# EAGLE schematic stm32-d40-platform (EAGLE 6.4)

## Sheet 1 of 3
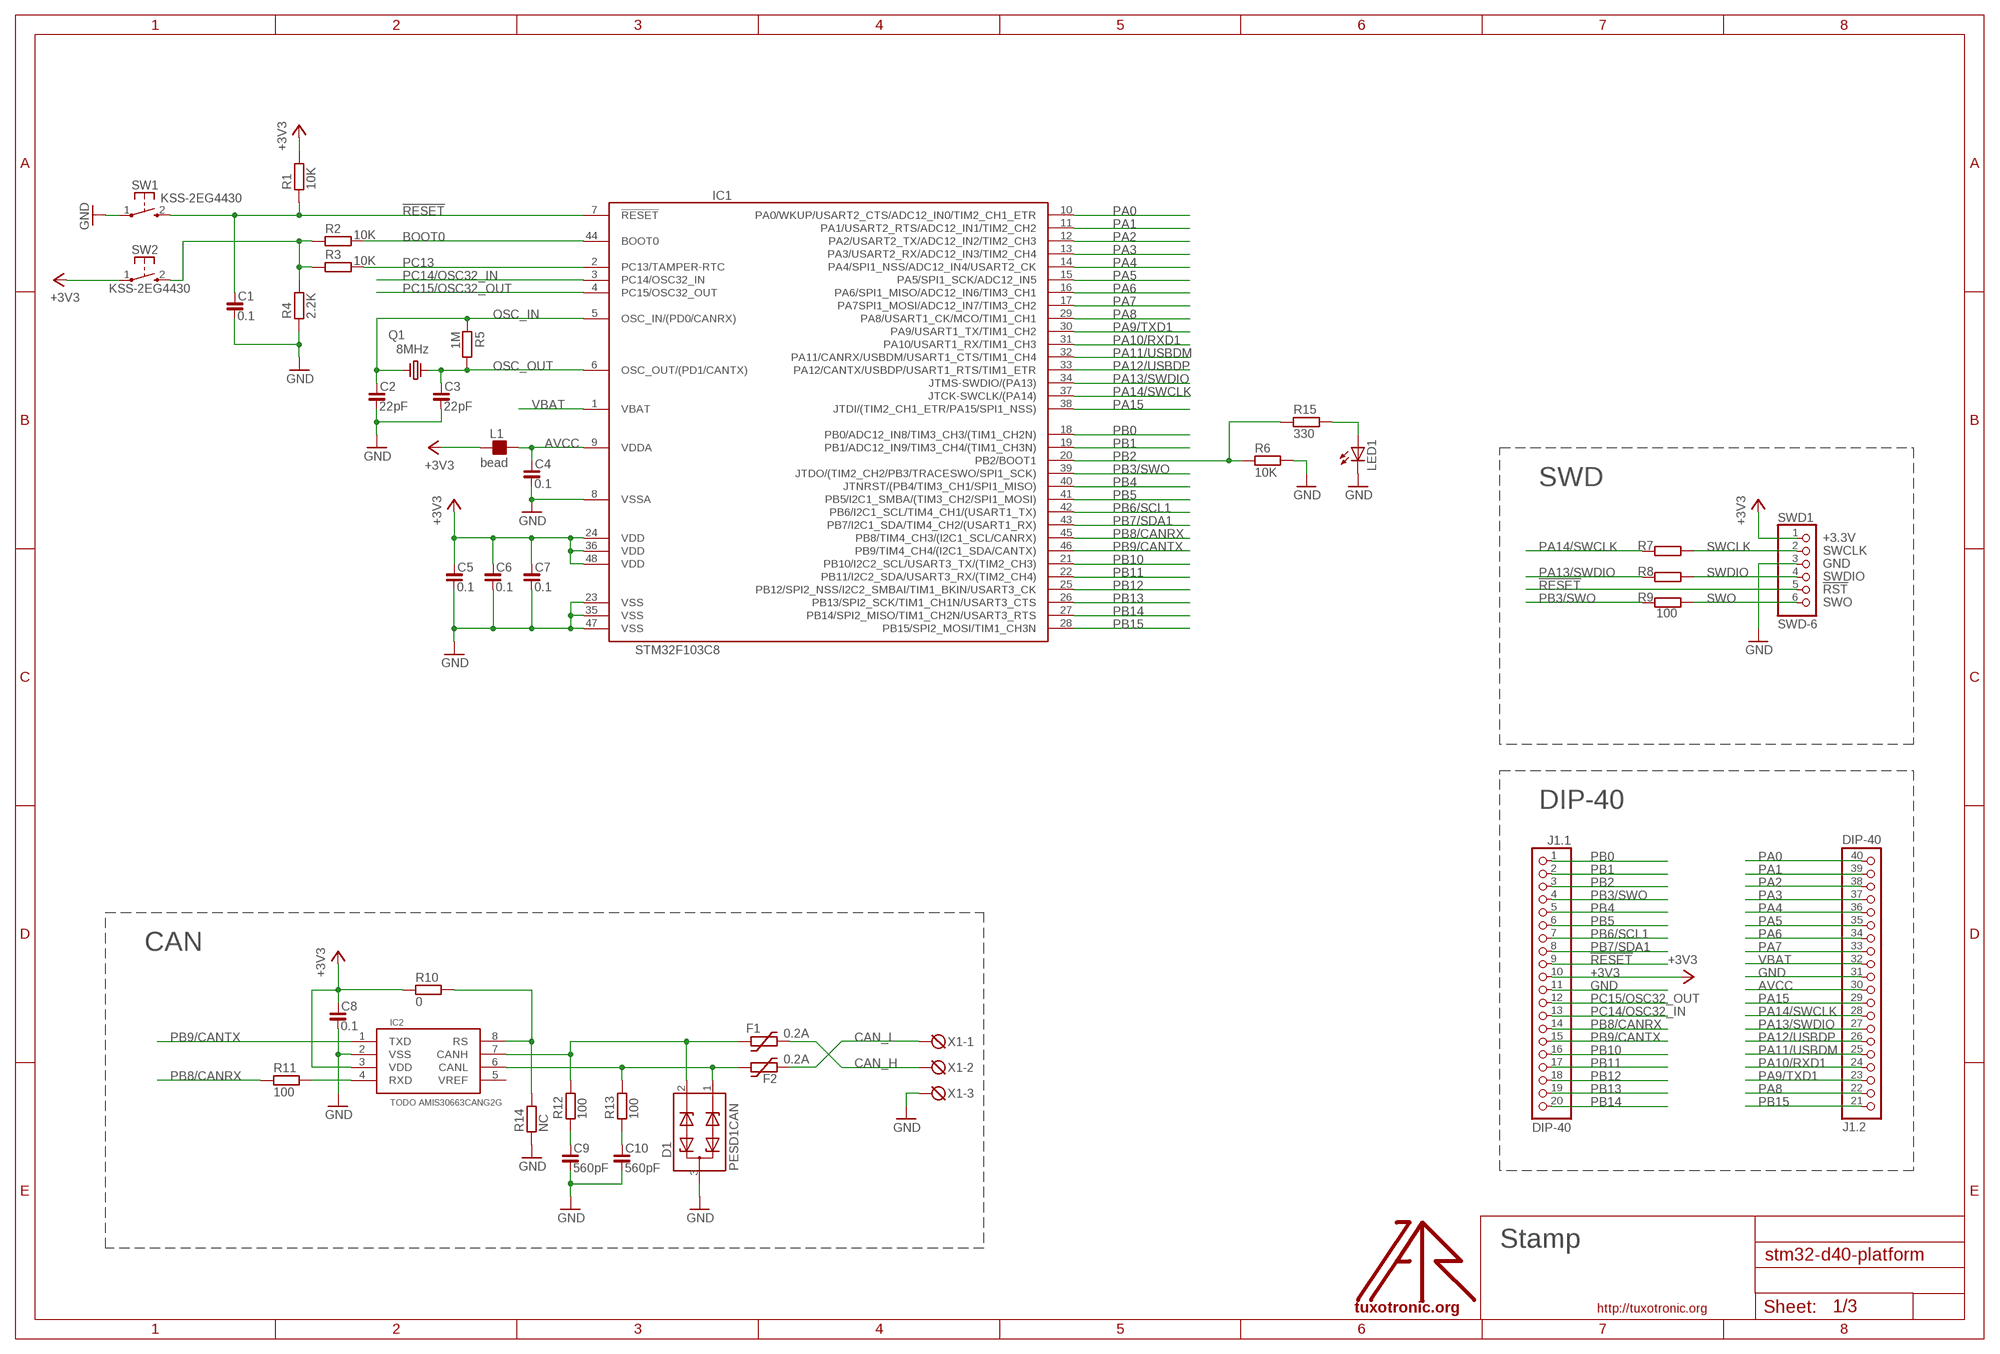
[diagram p0: schematic, sheet 1]

### Parts
C1  0.1  C_0603  [C0603]
C2  22pF  C_0603  [C0603]
C3  22pF  C_0603  [C0603]
C4  0.1  C_0603  [C0603]
C5  0.1  C_0603  [C0603]
C6  0.1  C_0603  [C0603]
C7  0.1  C_0603  [C0603]
C8  0.1  C_0603  [C0603]
C9  560pF  C_0603  [C0603]
C10  560pF  C_0603  [C0603]
D1  PESD1CAN  [SOT23]
F1  0.2A  1206L  [1206L]
F2  0.2A  1206L  [1206L]
IC1  STM32F103C8  [LQFP48]
IC2  TODO AMIS30663CANG2G  SN65HVD230  [SO08]
J1  DIP-40  [DIP-40]
L1  bead  FB_0603  [L0603]
LED1  LEDCHIPLED_0603  [CHIPLED_0603]
Q1  8MHz  CRYSTAL-HC49S  [HC49/S]
R1  10K  R_0603  [R0603]
R2  10K  R_0603  [R0603]
R3  10K  R_0603  [R0603]
R4  2.2K  R_0603  [R0603]
R5  1M  R_0603  [R0603]
R6  10K  R_0603  [R0603]
R7  100  R_0603  [R0603]
R8  100  R_0603  [R0603]
R9  100  R_0603  [R0603]
R10  0  R_0603  [R0603]
R11  100  R_0603  [R0603]
R12  100  R_0603  [R0603]
R13  100  R_0603  [R0603]
R14  NC  R_0603  [R0603]
R15  330  R_0603  [R0603]
SW1  KSS-2EG4430  [KSS-2EG4430]
SW2  KSS-2EG4430  [KSS-2EG4430]
SWD1  SWD-6  [JTAG6PIN]
U$  LOGO  [TT_LOGO]
X1  DG3XX-03-3.5  [DG350-3.5-03P]

### Nets
!RESET: C1.1 IC1.7(!RESET) J1.9 R1.1 SW1.2(S) SWD1.5 ; also sheet 3
+3V3: C5.1 C6.1 C7.1 C8.1 IC1.24(VDD) IC1.36(VDD) IC1.48(VDD) IC2.3(VDD) J1.10 L1.1 R1.2 R10.1 SW2.1(P) SWD1.1 ; also sheet 3
AVCC: C4.1 IC1.9(VDDA) J1.30 L1.2
BOOT0: IC1.44(BOOT0) R2.2
CAN_CTRL: IC2.8(RS) R10.2 R14.2
CAN_H: F1.P$2 X1.2
CAN_L: F2.P$2 X1.1
GND: C1.2 C2.2 C3.2 C4.2 C5.2 C6.2 C7.2 C8.2 C9.2 C10.2 D1.3 IC1.8(VSSA) IC1.23(VSS) IC1.35(VSS) IC1.47(VSS) IC2.2(VSS) J1.11 J1.31 LED1.C R4.1 R6.2 R14.1 SW1.1(P) SWD1.3 X1.3 ; also sheet 2,3
N$1: R2.1 R3.1 R4.2 SW2.2(S)
N$5: LED1.A R15.2
N$7: IC2.4(RXD) R11.2
N$51: D1.2 F1.P$1 IC2.7(CANH) R12.2
N$52: D1.1 F2.P$1 IC2.6(CANL) R13.2
N$54: C10.1 R13.1
N$55: C9.1 R12.1
OSC_IN: C2.1 IC1.5(OSC_IN/(PD0/CANRX)) Q1.1 R5.1
OSC_OUT: C3.1 IC1.6(OSC_OUT/(PD1/CANTX)) Q1.2 R5.2
PA0: IC1.10(PA0/WKUP/USART2_CTS/ADC12_IN0/TIM2_CH1_ETR) J1.40
PA1: IC1.11(PA1/USART2_RTS/ADC12_IN1/TIM2_CH2) J1.39
PA2: IC1.12(PA2/USART2_TX/ADC12_IN2/TIM2_CH3) J1.38
PA3: IC1.13(PA3/USART2_RX/ADC12_IN3/TIM2_CH4) J1.37
PA4: IC1.14(PA4/SPI1_NSS/ADC12_IN4/USART2_CK) J1.36
PA5: IC1.15(PA5/SPI1_SCK/ADC12_IN5) J1.35
PA6: IC1.16(PA6/SPI1_MISO/ADC12_IN6/TIM3_CH1) J1.34
PA7: IC1.17(PA7SPI1_MOSI/ADC12_IN7/TIM3_CH2) J1.33
PA8: IC1.29(PA8/USART1_CK/MCO/TIM1_CH1) J1.22
PA9/TXD1: IC1.30(PA9/USART1_TX/TIM1_CH2) J1.23
PA10/RXD1: IC1.31(PA10/USART1_RX/TIM1_CH3) J1.24
PA11/USBDM: IC1.32(PA11/CANRX/USBDM/USART1_CTS/TIM1_CH4) J1.25
PA12/USBDP: IC1.33(PA12/CANTX/USBDP/USART1_RTS/TIM1_ETR) J1.26
PA13/SWDIO: IC1.34(JTMS-SWDIO/(PA13)) J1.27 R8.1
PA14/SWCLK: IC1.37(JTCK-SWCLK/(PA14)) J1.28 R7.1
PA15: IC1.38(JTDI/(TIM2_CH1_ETR/PA15/SPI1_NSS)) J1.29
PB0: IC1.18(PB0/ADC12_IN8/TIM3_CH3/(TIM1_CH2N)) J1.1
PB1: IC1.19(PB1/ADC12_IN9/TIM3_CH4/(TIM1_CH3N)) J1.2
PB2: IC1.20(PB2/BOOT1) J1.3 R6.1 R15.1
PB3/SWO: IC1.39(JTDO/(TIM2_CH2/PB3/TRACESWO/SPI1_SCK)) J1.4 R9.1
PB4: IC1.40(JTNRST/(PB4/TIM3_CH1/SPI1_MISO)) J1.5
PB5: IC1.41(PB5/I2C1_SMBA/(TIM3_CH2/SPI1_MOSI)) J1.6
PB6/SCL1: IC1.42(PB6/I2C1_SCL/TIM4_CH1/(USART1_TX)) J1.7
PB7/SDA1: IC1.43(PB7/I2C1_SDA/TIM4_CH2/(USART1_RX)) J1.8
PB8/CANRX: IC1.45(PB8/TIM4_CH3/(I2C1_SCL/CANRX)) J1.14 R11.1
PB9/CANTX: IC1.46(PB9/TIM4_CH4/(I2C1_SDA/CANTX)) IC2.1(TXD) J1.15
PB10: IC1.21(PB10/I2C2_SCL/USART3_TX/(TIM2_CH3)) J1.16
PB11: IC1.22(PB11/I2C2_SDA/USART3_RX/(TIM2_CH4)) J1.17
PB12: IC1.25(PB12/SPI2_NSS/I2C2_SMBAI/TIM1_BKIN/USART3_CK) J1.18
PB13: IC1.26(PB13/SPI2_SCK/TIM1_CH1N/USART3_CTS) J1.19
PB14: IC1.27(PB14/SPI2_MISO/TIM1_CH2N/USART3_RTS) J1.20
PB15: IC1.28(PB15/SPI2_MOSI/TIM1_CH3N) J1.21
PC13: IC1.2(PC13/TAMPER-RTC) R3.2
PC14/OSC32_IN: IC1.3(PC14/OSC32_IN) J1.13
PC15/OSC32_OUT: IC1.4(PC15/OSC32_OUT) J1.12
SWCLK: R7.2 SWD1.2 ; also sheet 3
SWDIO: R8.2 SWD1.4 ; also sheet 3
SWO: R9.2 SWD1.6 ; also sheet 3
VBAT: IC1.1(VBAT) J1.32
Unconnected: IC2.5(VREF)

### Notes on the sheet
- SWD
- DIP-40
- CAN
- Stamp

## Sheet 2 of 3
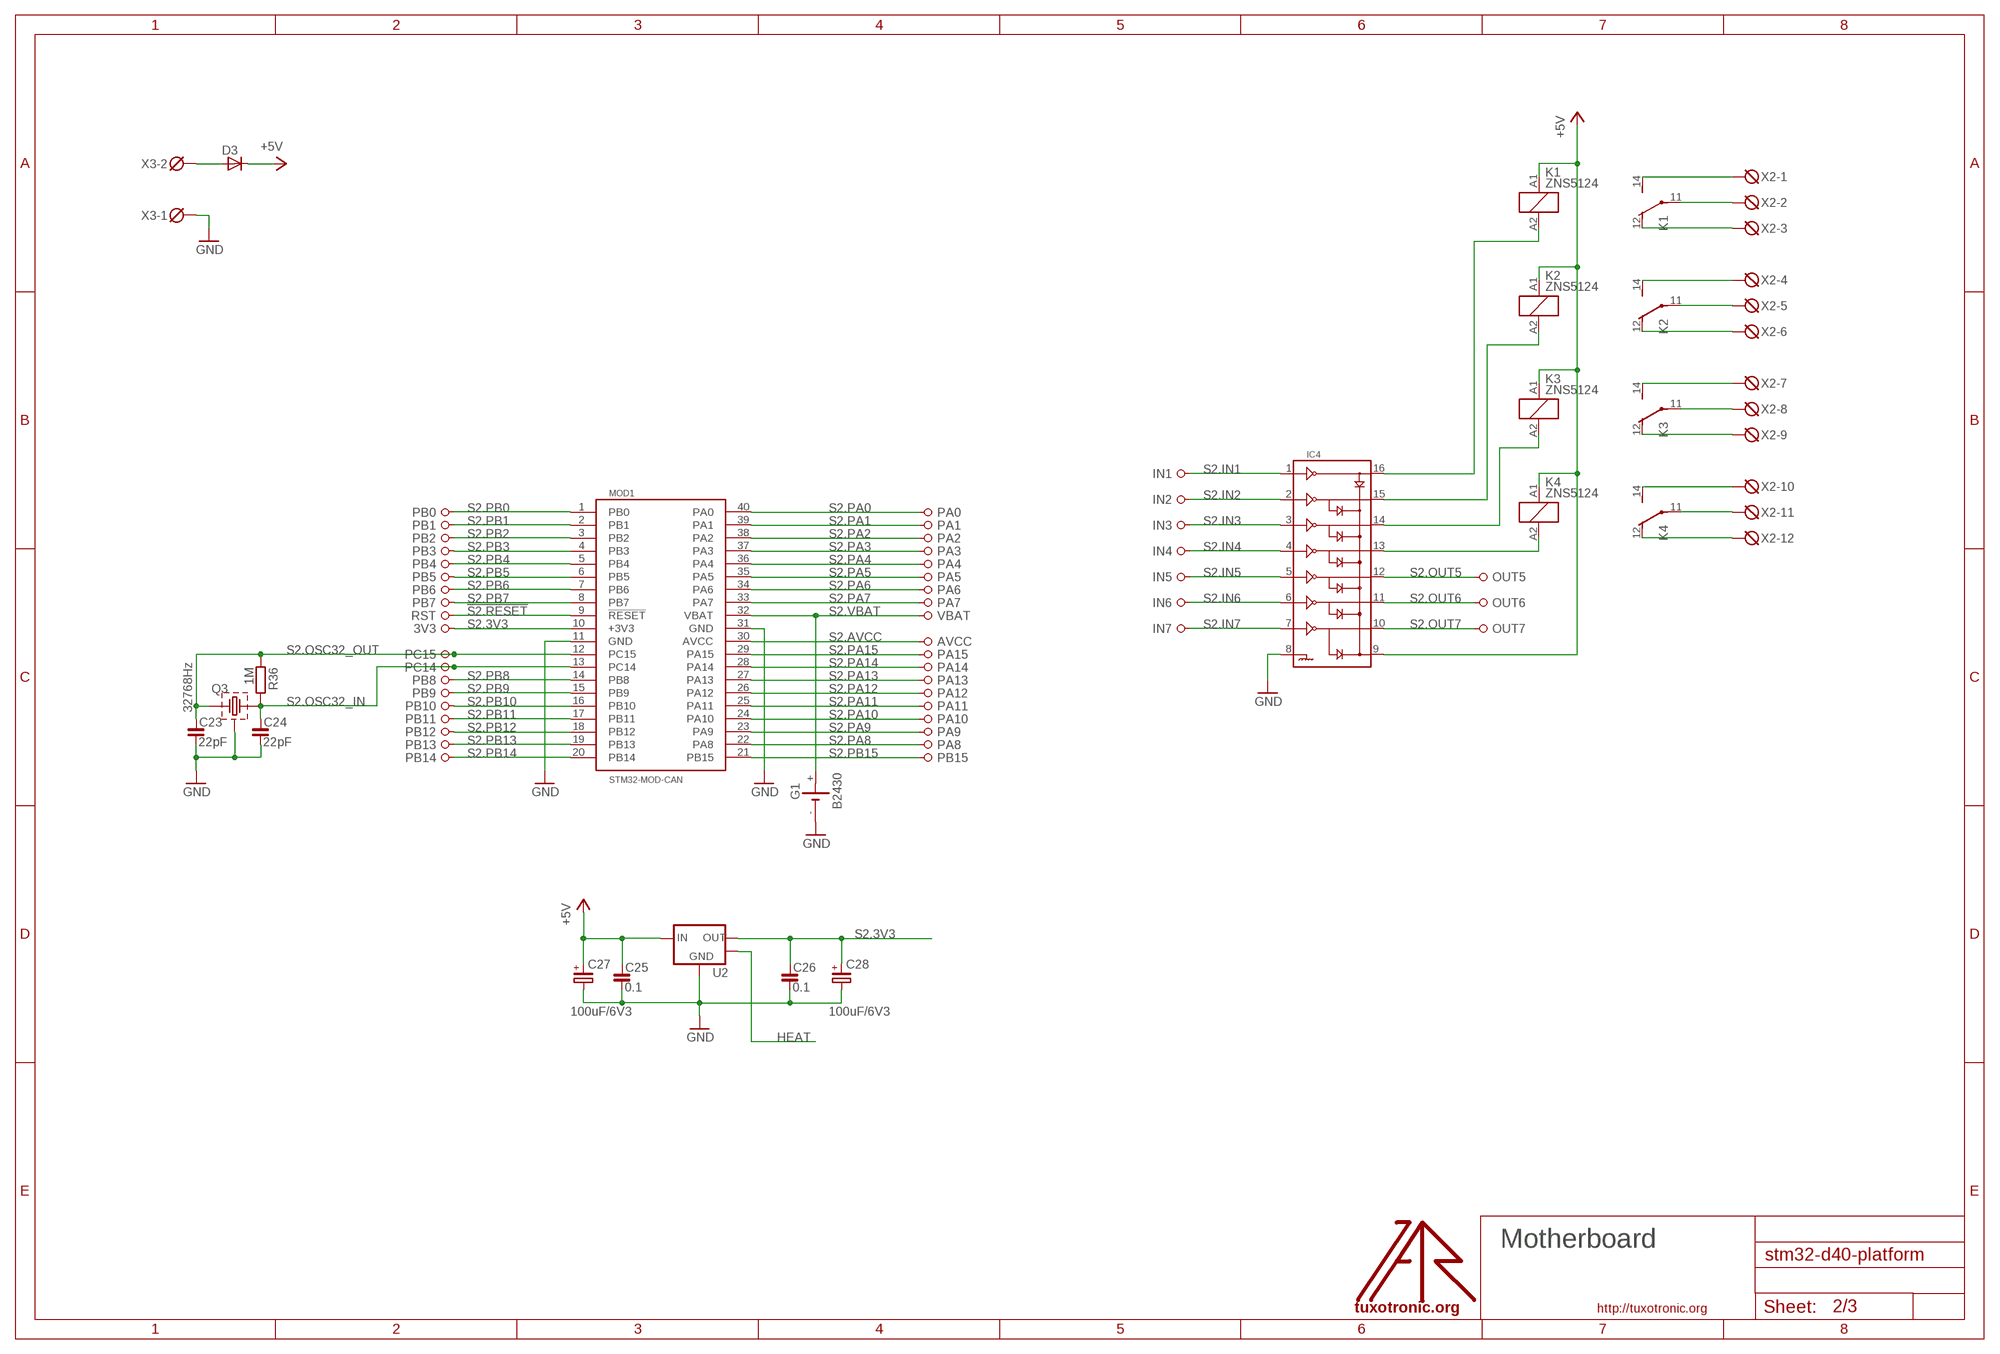
[diagram p1: schematic, sheet 2]

### Parts
3V3  PIN-1X1_2.54  [1X01]
AVCC  PIN-1X1_2.54  [1X01]
C23  22pF  C_0805  [C0805]
C24  22pF  C_0805  [C0805]
C25  0.1  C_0805  [C0805]
C26  0.1  C_0805  [C0805]
C27  100uF/6V3  CP_E-035X080  [CE-035X080]
C28  100uF/6V3  CP_E-035X080  [CE-035X080]
D3  D-SMB  [SMB]
G1  B2430  [B2430]
IC4  ULN2003D  [SO16]
IN1  PIN-1X1_2.54  [1X01]
IN2  PIN-1X1_2.54  [1X01]
IN3  PIN-1X1_2.54  [1X01]
IN4  PIN-1X1_2.54  [1X01]
IN5  PIN-1X1_2.54  [1X01]
IN6  PIN-1X1_2.54  [1X01]
IN7  PIN-1X1_2.54  [1X01]
K1  ZNS5124  [ZN5]
K2  ZNS5124  [ZN5]
K3  ZNS5124  [ZN5]
K4  ZNS5124  [ZN5]
MOD1  STM32-MOD-CAN  [DIL40]
OUT5  PIN-1X1_2.54  [1X01]
OUT6  PIN-1X1_2.54  [1X01]
OUT7  PIN-1X1_2.54  [1X01]
PA0  PIN-1X1_2.54  [1X01]
PA1  PIN-1X1_2.54  [1X01]
PA2  PIN-1X1_2.54  [1X01]
PA3  PIN-1X1_2.54  [1X01]
PA4  PIN-1X1_2.54  [1X01]
PA5  PIN-1X1_2.54  [1X01]
PA6  PIN-1X1_2.54  [1X01]
PA7  PIN-1X1_2.54  [1X01]
PA8  PIN-1X1_2.54  [1X01]
PA9  PIN-1X1_2.54  [1X01]
PA10  PIN-1X1_2.54  [1X01]
PA11  PIN-1X1_2.54  [1X01]
PA12  PIN-1X1_2.54  [1X01]
PA13  PIN-1X1_2.54  [1X01]
PA14  PIN-1X1_2.54  [1X01]
PA15  PIN-1X1_2.54  [1X01]
PB0  PIN-1X1_2.54  [1X01]
PB1  PIN-1X1_2.54  [1X01]
PB2  PIN-1X1_2.54  [1X01]
PB3  PIN-1X1_2.54  [1X01]
PB4  PIN-1X1_2.54  [1X01]
PB5  PIN-1X1_2.54  [1X01]
PB6  PIN-1X1_2.54  [1X01]
PB7  PIN-1X1_2.54  [1X01]
PB8  PIN-1X1_2.54  [1X01]
PB9  PIN-1X1_2.54  [1X01]
PB10  PIN-1X1_2.54  [1X01]
PB11  PIN-1X1_2.54  [1X01]
PB12  PIN-1X1_2.54  [1X01]
PB13  PIN-1X1_2.54  [1X01]
PB14  PIN-1X1_2.54  [1X01]
PB15  PIN-1X1_2.54  [1X01]
PC14  PIN-1X1_2.54  [1X01]
PC15  PIN-1X1_2.54  [1X01]
Q3  32768Hz  CRSTL3-  [TC38H-G]
R36  1M  R_0805  [R0805]
RST  PIN-1X1_2.54  [1X01]
U2  LM1117-3.3  [SOT223]
U$1  LOGO  [TT_LOGO]
VBAT  PIN-1X1_2.54  [1X01]
X2  DG3XX-12-5.0  [DG306-5.0-12P]
X3  DG3XX-02-5.0  [DG306-5.0-02P]

### Nets
!S2.RESET: MOD1.9(!RESET) RST.1
+5V: C25.1 C27.+ D3.C IC4.9 K1.A1 K2.A1 K3.A1 K4.A1 U2.3(IN) ; also sheet 3
GND: C23.2 C24.2 C25.2 C26.2 C27.- C28.- G1.- IC4.8 MOD1.11(GND) MOD1.31(GND) Q3.GND U2.1(GND) X3.1 ; also sheet 1,3
HEAT: U2.4(MASS)
N$11: D3.A X3.2
N$64: K1.14(2:S) X2.1
N$65: K1.11(2:P) X2.2
N$66: K1.12(2:O) X2.3
N$67: K2.14(2:S) X2.4
N$68: K2.11(2:P) X2.5
N$69: K2.12(2:O) X2.6
N$70: K3.14(2:S) X2.7
N$71: K3.11(2:P) X2.8
N$72: K3.12(2:O) X2.9
N$73: K4.14(2:S) X2.10
N$74: K4.11(2:P) X2.11
N$75: K4.12(2:O) X2.12
N$366: IC4.13 K4.A2
N$367: IC4.14 K3.A2
N$368: IC4.15 K2.A2
N$369: IC4.16 K1.A2
S2.3V3: 3V3.1 C26.1 C28.+ MOD1.10(+3V3) U2.2(OUT)
S2.AVCC: AVCC.1 MOD1.30(AVCC)
S2.IN1: IC4.1 IN1.1
S2.IN2: IC4.2 IN2.1
S2.IN3: IC4.3 IN3.1
S2.IN4: IC4.4 IN4.1
S2.IN5: IC4.5 IN5.1
S2.IN6: IC4.6 IN6.1
S2.IN7: IC4.7 IN7.1
S2.OSC32_IN: C24.1 MOD1.13(PC14) PC14.1 Q3.2 R36.2
S2.OSC32_OUT: C23.1 MOD1.12(PC15) PC15.1 Q3.1 R36.1
S2.OUT5: IC4.12 OUT5.1
S2.OUT6: IC4.11 OUT6.1
S2.OUT7: IC4.10 OUT7.1
S2.PA0: MOD1.40(PA0) PA0.1
S2.PA1: MOD1.39(PA1) PA1.1
S2.PA2: MOD1.38(PA2) PA2.1
S2.PA3: MOD1.37(PA3) PA3.1
S2.PA4: MOD1.36(PA4) PA4.1
S2.PA5: MOD1.35(PA5) PA5.1
S2.PA6: MOD1.34(PA6) PA6.1
S2.PA7: MOD1.33(PA7) PA7.1
S2.PA8: MOD1.22(PA8) PA8.1
S2.PA9: MOD1.23(PA9) PA9.1
S2.PA10: MOD1.24(PA10) PA10.1
S2.PA11: MOD1.25(PA11) PA11.1
S2.PA12: MOD1.26(PA12) PA12.1
S2.PA13: MOD1.27(PA13) PA13.1
S2.PA14: MOD1.28(PA14) PA14.1
S2.PA15: MOD1.29(PA15) PA15.1
S2.PB0: MOD1.1(PB0) PB0.1
S2.PB1: MOD1.2(PB1) PB1.1
S2.PB2: MOD1.3(PB2) PB2.1
S2.PB3: MOD1.4(PB3) PB3.1
S2.PB4: MOD1.5(PB4) PB4.1
S2.PB5: MOD1.6(PB5) PB5.1
S2.PB6: MOD1.7(PB6) PB6.1
S2.PB7: MOD1.8(PB7) PB7.1
S2.PB8: MOD1.14(PB8) PB8.1
S2.PB9: MOD1.15(PB9) PB9.1
S2.PB10: MOD1.16(PB10) PB10.1
S2.PB11: MOD1.17(PB11) PB11.1
S2.PB12: MOD1.18(PB12) PB12.1
S2.PB13: MOD1.19(PB13) PB13.1
S2.PB14: MOD1.20(PB14) PB14.1
S2.PB15: MOD1.21(PB15) PB15.1
S2.VBAT: G1.+ MOD1.32(VBAT) VBAT.1

### Notes on the sheet
- Motherboard

## Sheet 3 of 3
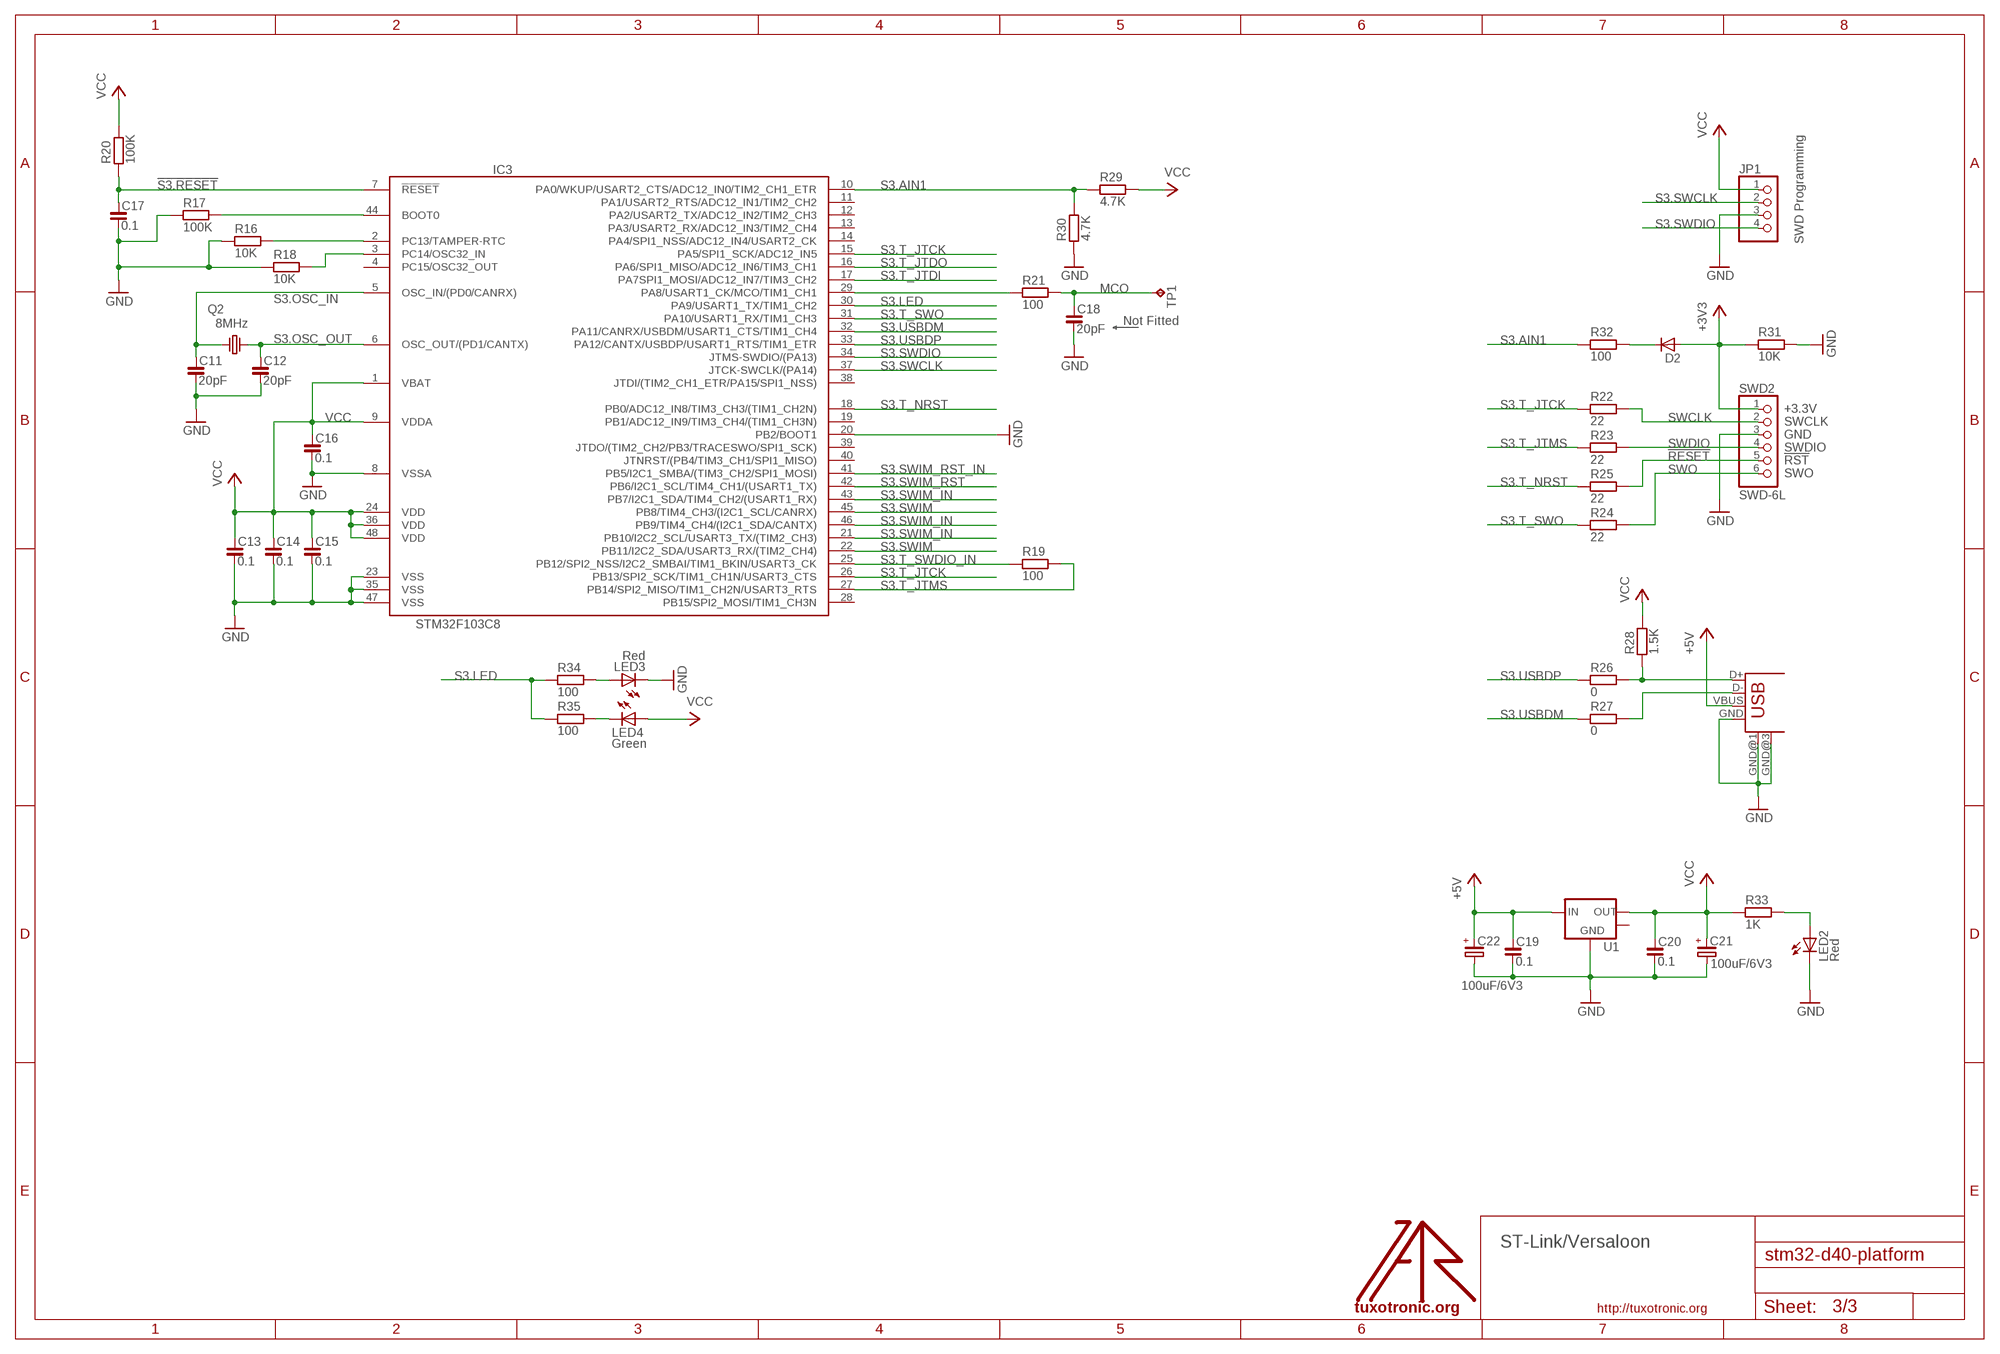
[diagram p2: schematic, sheet 3]

### Parts
C11  20pF  C_0603  [C0603]
C12  20pF  C_0603  [C0603]
C13  0.1  C_0603  [C0603]
C14  0.1  C_0603  [C0603]
C15  0.1  C_0603  [C0603]
C16  0.1  C_0603  [C0603]
C17  0.1  C_0603  [C0603]
C18  20pF  C_0603  [C0603]
C19  0.1  C_0603  [C0603]
C20  0.1  C_0603  [C0603]
C21  100uF/6V3  CP_SMCC  [SMC_C]
C22  100uF/6V3  CP_SMCC  [SMC_C]
D2  BAT54A1-C3  [SOT23]
IC3  STM32F103C8  [LQFP48]
JP1  PINHD-1X4_2.00  [1X04M]
LED2  Red  LEDCHIPLED_0603  [CHIPLED_0603]
LED3  Red  LEDCHIPLED_0603  [CHIPLED_0603]
LED4  Green  LEDCHIPLED_0603  [CHIPLED_0603]
Q2  8MHz  CRYSTAL-HC49S  [HC49/S]
R16  10K  R_0603  [R0603]
R17  100K  R_0603  [R0603]
R18  10K  R_0603  [R0603]
R19  100  R_0603  [R0603]
R20  100K  R_0603  [R0603]
R21  100  R_0603  [R0603]
R22  22  R_0603  [R0603]
R23  22  R_0603  [R0603]
R24  22  R_0603  [R0603]
R25  22  R_0603  [R0603]
R26  0  R_0603  [R0603]
R27  0  R_0603  [R0603]
R28  1.5K  R_0603  [R0603]
R29  4.7K  R_0603  [R0603]
R30  4.7K  R_0603  [R0603]
R31  10K  R_0603  [R0603]
R32  100  R_0603  [R0603]
R33  1K  R_0603  [R0603]
R34  100  R_0603  [R0603]
R35  100  R_0603  [R0603]
S3.LOGO  LOGO  [TT_LOGO]
SWD2  SWD-6L  [SWD6PIN_L]
TP1  TPB1,27  [B1,27]
U1  LM1117-3.3  [SOT223]
USB1  USB-MB-S2  [USB-MB-S2]

### Nets
!RESET: R25.2 SWD2.5 ; also sheet 1
!S3.RESET: C17.1 IC3.7(!RESET) R20.1
+3V3: D2.1(A) R31.1 SWD2.1 ; also sheet 1
+5V: C19.1 C22.+ U1.3(IN) USB1.VBUS ; also sheet 2
GND: C11.2 C12.2 C13.2 C14.2 C15.2 C16.2 C17.2 C18.2 C19.2 C20.2 C21.- C22.- IC3.8(VSSA) IC3.20(PB2/BOOT1) IC3.23(VSS) IC3.35(VSS) IC3.47(VSS) JP1.3 LED2.C LED3.C R16.1 R17.1 R18.1 R30.1 R31.2 SWD2.3 U1.1(GND) USB1.GND USB1.GND@1(GND) USB1.GND@3(GND) ; also sheet 1,2
MCO: C18.1 R21.2 TP1.PP(TP)
N$2: IC3.44(BOOT0) R17.2
N$3: IC3.3(PC14/OSC32_IN) R18.2
N$4: IC3.2(PC13/TAMPER-RTC) R16.2
N$45: IC3.29(PA8/USART1_CK/MCO/TIM1_CH1) R21.1
N$47: R26.2 R28.1 USB1.D+
N$48: R27.2 USB1.D-
N$49: D2.3(C) R32.2
N$50: LED2.A R33.2
N$53: LED4.C R35.2
N$56: LED3.A R34.2
S3.AIN1: IC3.10(PA0/WKUP/USART2_CTS/ADC12_IN0/TIM2_CH1_ETR) R29.1 R30.2 R32.1
S3.LED: IC3.30(PA9/USART1_TX/TIM1_CH2) R34.1 R35.1
S3.OSC_IN: C11.1 IC3.5(OSC_IN/(PD0/CANRX)) Q2.1
S3.OSC_OUT: C12.1 IC3.6(OSC_OUT/(PD1/CANTX)) Q2.2
S3.SWCLK: IC3.37(JTCK-SWCLK/(PA14)) JP1.2
S3.SWDIO: IC3.34(JTMS-SWDIO/(PA13)) JP1.4
S3.SWIM: IC3.22(PB11/I2C2_SDA/USART3_RX/(TIM2_CH4)) IC3.45(PB8/TIM4_CH3/(I2C1_SCL/CANRX))
S3.SWIM_IN: IC3.21(PB10/I2C2_SCL/USART3_TX/(TIM2_CH3)) IC3.43(PB7/I2C1_SDA/TIM4_CH2/(USART1_RX)) IC3.46(PB9/TIM4_CH4/(I2C1_SDA/CANTX))
S3.SWIM_RST: IC3.42(PB6/I2C1_SCL/TIM4_CH1/(USART1_TX))
S3.SWIM_RST_IN: IC3.41(PB5/I2C1_SMBA/(TIM3_CH2/SPI1_MOSI))
S3.T_JTCK: IC3.15(PA5/SPI1_SCK/ADC12_IN5) IC3.26(PB13/SPI2_SCK/TIM1_CH1N/USART3_CTS) R22.1
S3.T_JTDI: IC3.17(PA7SPI1_MOSI/ADC12_IN7/TIM3_CH2)
S3.T_JTDO: IC3.16(PA6/SPI1_MISO/ADC12_IN6/TIM3_CH1)
S3.T_JTMS: IC3.27(PB14/SPI2_MISO/TIM1_CH2N/USART3_RTS) R19.2 R23.1
S3.T_NRST: IC3.18(PB0/ADC12_IN8/TIM3_CH3/(TIM1_CH2N)) R25.1
S3.T_SWDIO_IN: IC3.25(PB12/SPI2_NSS/I2C2_SMBAI/TIM1_BKIN/USART3_CK) R19.1
S3.T_SWO: IC3.31(PA10/USART1_RX/TIM1_CH3) R24.1
S3.USBDM: IC3.32(PA11/CANRX/USBDM/USART1_CTS/TIM1_CH4) R27.1
S3.USBDP: IC3.33(PA12/CANTX/USBDP/USART1_RTS/TIM1_ETR) R26.1
SWCLK: R22.2 SWD2.2 ; also sheet 1
SWDIO: R23.2 SWD2.4 ; also sheet 1
SWO: R24.2 SWD2.6 ; also sheet 1
VCC: C13.1 C14.1 C15.1 C16.1 C20.1 C21.+ IC3.1(VBAT) IC3.9(VDDA) IC3.24(VDD) IC3.36(VDD) IC3.48(VDD) JP1.1 LED4.A R20.2 R28.2 R29.2 R33.1 U1.2(OUT)
Unconnected: IC3.4(PC15/OSC32_OUT) IC3.11(PA1/USART2_RTS/ADC12_IN1/TIM2_CH2) IC3.12(PA2/USART2_TX/ADC12_IN2/TIM2_CH3) IC3.13(PA3/USART2_RX/ADC12_IN3/TIM2_CH4) IC3.14(PA4/SPI1_NSS/ADC12_IN4/USART2_CK) IC3.19(PB1/ADC12_IN9/TIM3_CH4/(TIM1_CH3N)) IC3.28(PB15/SPI2_MOSI/TIM1_CH3N) IC3.38(JTDI/(TIM2_CH1_ETR/PA15/SPI1_NSS)) IC3.39(JTDO/(TIM2_CH2/PB3/TRACESWO/SPI1_SCK)) IC3.40(JTNRST/(PB4/TIM3_CH1/SPI1_MISO)) U1.4(MASS)

### Notes on the sheet
- SWD Programming
- Not Fitted
- ST-Link/Versaloon

## Library data of the parts
3V3 AVCC IN1-IN7 OUT5-OUT7 PA0 PA1-PA15 PB0 PB1-PB15 PC14 PC15 RST VBAT = pinhead-fixdrills:PIN-1X1: PIN HEADER
C1-C20 C23-C26 = rc-master-smd:C_: NON-POLARIZED CAP
C21 C22 = rc-master-smd:CP_: POLARIZED CAP
C27 C28 = rc-master:CP_: POLARIZED CAP
D1 = protect:PESD1CAN: Features Due to the integrated diode structure only one small SOT23 package is needed to protect two CAN bus lines Max. peak pulse power: PPP = 200 W at tp = 8/20 ?s Low clamping voltage: VCL = 40 V at IPP = 1 A Ultra low leakage current: IRM < 1 nA ESD protection up to 23 kV IEC 61000-4-2, level 4 (ESD) IEC 61000-4-5 (surge); IPP = 3 A at tp = 8/20 ?s Small SMD plastic package Applications CAN bus protection Automotive applications
D2 = diodes:BAT54: DIODE
D3 = diodes:D-: DIODE
F1 F2 = ptc-littlefuse:1206L
G1 = battery:B2430: LI BATTERY
IC1 IC3 = stm32:STM32F103C
IC2 = interfaces:SN65HVD230: CAN PHY driver
IC4 = transistor-arrays:ULN2003: OUTPUT CURRENT 500mA PER DRIVER (600mA PEAK) OUTPUT VOLTAGE 50V
J1 = stamp:DIP-40
JP1 = pinhead-fixdrills:PINHD-1X4: PIN HEADER
K1-K4 = myrelays:ZNS5*: Miniature Power PCB Relay SCHRACK 1pole 10 A Source: http://www.schrack.com/.. 5847.pdf
L1 = rc-master-smd:FB_: FERRITE BEAD
LED1-LED4 = led:LED: LED OSRAM: - CHIPLED LG R971, LG N971, LY N971, LG Q971, LY Q971, LO R971, LY R971 LH N974, LH R974 LS Q976, LO Q976, LY Q976 LO Q996 - Hyper CHIPLED LW Q18S LB Q993, LB Q99A, LB R99A - SideLED LS A670, LO A670, LY A670, LG A670, LP A670 LB A673, LV A673, LT A673, LW A673 LH A674 LY A675 LS A676, LA A676, LO A676, LY A676, LW A676 LS A679, LY A679, LG A679 - Hyper Micro SIDELED® LS Y876, LA Y876, LO Y876, LY Y876 LT Y87S - SmartLED LW L88C, LW L88S LB L89C, LB L89S, LG L890 LS L89K, LO L89K, LY L89K LS L896, LA L896, LO L896, LY L896 - TOPLED LS T670, LO T670, LY T670, LG T670, LP T670 LSG T670, LSP T670, LSY T670, LOP T670, LYG T670 LG T671, LOG T671, LSG T671 LB T673, LV T673, LT T673, LW T673 LH T674 LS T676, LA T676, LO T676, LY T676, LB T676, LH T676, LSB T676, LW T676 LB T67C, LV T67C, LT T67C, LS T67K, LO T67K, LY T67K, LW E67C LS E67B, LA E67B, LO E67B, LY E67B, LB E67C, LV E67C, LT E67C LW T67C LS T679, LY T679, LG T679 LS T770, LO T770, LY T770, LG T770, LP T770 LB T773, LV T773, LT T773, LW T773 LH T774 LS E675, LA E675, LY E675, LS T675 LS T776, LA T776, LO T776, LY T776, LB T776 LHGB T686 LT T68C, LB T68C - Hyper Mini TOPLED® LB M676 - Mini TOPLED Santana® LG M470 LS M47K, LO M47K, LY M47K Source: http://www.osram.convergy.de - LUMILED® LXK2-PW12-R00, LXK2-PW12-S00, LXK2-PW14-U00, LXK2-PW14-V00 LXK2-PM12-R00, LXK2-PM12-S00, LXK2-PM14-U00 LXK2-PE12-Q00, LXK2-PE12-R00, LXK2-PE12-S00, LXK2-PE14-T00, LXK2-PE14-U00 LXK2-PB12-K00, LXK2-PB12-L00, LXK2-PB12-M00, LXK2-PB14-N00, LXK2-PB14-P00, LXK2-PB14-Q00 LXK2-PR12-L00, LXK2-PR12-M00, LXK2-PR14-Q00, LXK2-PR14-R00 LXK2-PD12-Q00, LXK2-PD12-R00, LXK2-PD12-S00 LXK2-PH12-R00, LXK2-PH12-S00 LXK2-PL12-P00, LXK2-PL12-Q00, LXK2-PL12-R00 Source: www.luxeon.com
MOD1 = stamp:STM32-MOD-CAN
Q1 Q2 = discrete:CRYSTAL-: CRYSTAL
Q3 = crystal:CRSTL3-
R1-R36 = rc-master-smd:R_: RESISTOR
S3.LOGO U$ U$1 = logo:LOGO
SW1 SW2 = buttons:KSS-2EG4430: Size: 3x6mm Height: 5mm from PCB Rating: DC12v 50mA Travel: 0.25±0.10mm Operating Force: 180±50gf Return Force: 60gf min Contact resistance: 100m? max Insulation resistance: 100M? min Operating life?50,000 cycles
SWD1 SWD2 = jtag:SWD-6: STM32Fx Discovery
TP1 = testpad:TP: Test pad
U1 U2 = vreg-linear:LM1117: Linear regulators
USB1 = usb:USB: USB Connectors
X1 = degson:DG3XX-03: DG350-3.5-03P DG306-5.0-03P
X2 = degson:DG3XX-12: DG350-3.5-12P DG306-5.0-12P
X3 = degson:DG3XX-02: DG350-3.5-02P DG306-5.0-02P